# EAGLE schematic attiny85 (EAGLE 9.6.2)
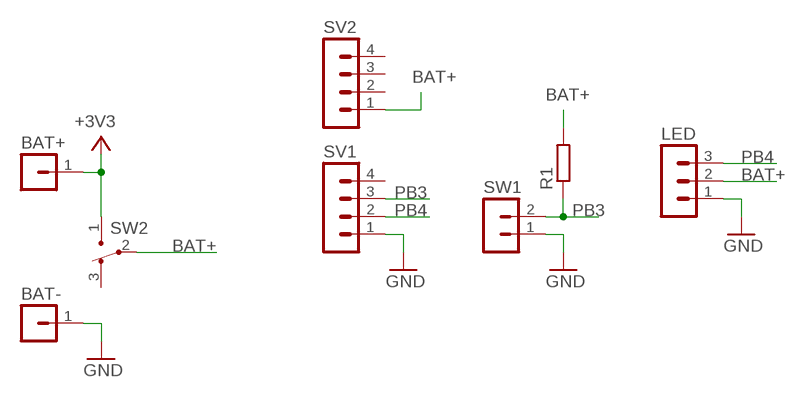
[diagram p0: schematic, sheet 1]

## Parts
BAT+  PINHEAD-MA01-1  [PINHEAD-MA01-1]
BAT-  PINHEAD-MA01-1  [PINHEAD-MA01-1]
LED  PINHEAD-MA03-1  [PINHEAD-MA03-1]
R1  R-EU_0204/5  [0204/5]
SV1  PINHEAD-MA04-1  [PINHEAD-MA04-1]
SV2  PINHEAD-MA04-1  [PINHEAD-MA04-1]
SW1  PINHEAD-MA02-1  [PINHEAD-MA02-1]
SW2  SW3-1  [SW3-1]

## Nets
+3V3: BAT+.1 SW2.1
BAT+: LED.2 R1.2 SV2.1 SW2.2
GND: BAT-.1 LED.1 SV1.1 SW1.1
PB3: R1.1 SV1.3 SW1.2
PB4: LED.3 SV1.2
Unconnected: SV1.4 SV2.2 SV2.3 SV2.4 SW2.3

## Library data of the parts
BAT+ BAT- = ytani1:PINHEAD-MA01-1
LED = ytani1:PINHEAD-MA03-1: PIN HEADER; OC_FARNELL: unknown; OC_NEWARK: unknown
R1 = rcl:R-EU_: RESISTOR, European symbol; SPICEPREFIX: R
SV1 SV2 = ytani1:PINHEAD-MA04-1: PIN HEADER; OC_FARNELL: unknown; OC_NEWARK: unknown
SW1 = ytani1:PINHEAD-MA02-1: PIN HEADER
SW2 = ytani1:SW3-1: Slide Switch 3x1 pin https://www.amazon.co.jp/gp/product/B01LYVYQNO/ SS12D00G3 2ポジションSPDT 1P2T 3ピン; MF: HiLetgo; URL_AMAZON: https://www.amazon.co.jp/gp/product/B01LYVYQNO/